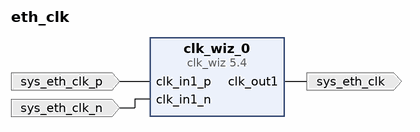
[diagram p0: block diagram of the top level]
# Vivado block design eth_clk, xc7a100tfgg484-2, Vivado 2017.4
create_bd_design eth_clk

create_bd_port -dir O -type clk sys_eth_clk
create_bd_port -dir I -type clk sys_eth_clk_p
set_property -dict {CONFIG.FREQ_HZ 200000000} [get_bd_ports sys_eth_clk_p]
create_bd_port -dir I -type clk sys_eth_clk_n
set_property -dict {CONFIG.FREQ_HZ 200000000} [get_bd_ports sys_eth_clk_n]

create_bd_cell -type ip -vlnv xilinx.com:ip:clk_wiz:5.4 clk_wiz_0
set_property -dict [list \
  CONFIG.PRIM_IN_FREQ 200.000 \
  CONFIG.CLKIN1_JITTER_PS 50.0 \
  CONFIG.CLKOUT2_USED true \
  CONFIG.NUM_OUT_CLKS 2 \
  CONFIG.CLKOUT1_REQUESTED_OUT_FREQ 200.000 \
  CONFIG.CLKOUT2_REQUESTED_OUT_FREQ 200.000 \
  CONFIG.PRIM_SOURCE Differential_clock_capable_pin \
  CONFIG.RESET_PORT resetn \
  CONFIG.MMCM_DIVCLK_DIVIDE 1 \
  CONFIG.MMCM_CLKFBOUT_MULT_F 5.000 \
  CONFIG.MMCM_CLKIN1_PERIOD 5.000 \
  CONFIG.MMCM_CLKIN2_PERIOD 10.0 \
  CONFIG.MMCM_CLKOUT0_DIVIDE_F 5.000 \
  CONFIG.MMCM_CLKOUT1_DIVIDE 5 \
  CONFIG.RESET_TYPE ACTIVE_LOW \
  CONFIG.CLKOUT1_JITTER 98.146 \
  CONFIG.CLKOUT1_PHASE_ERROR 89.971 \
  CONFIG.CLKOUT2_JITTER 98.146 \
  CONFIG.CLKOUT2_PHASE_ERROR 89.971 \
] [get_bd_cells clk_wiz_0]

# ---- connections ----

connect_bd_net [get_bd_pins clk_wiz_0/clk_out1] [get_bd_ports sys_eth_clk]
connect_bd_net [get_bd_ports sys_eth_clk_p] [get_bd_pins clk_wiz_0/clk_in1_p]
connect_bd_net [get_bd_ports sys_eth_clk_n] [get_bd_pins clk_wiz_0/clk_in1_n]

validate_bd_design
save_bd_design
